# Altium schematic sheet button.SchDoc
size A4
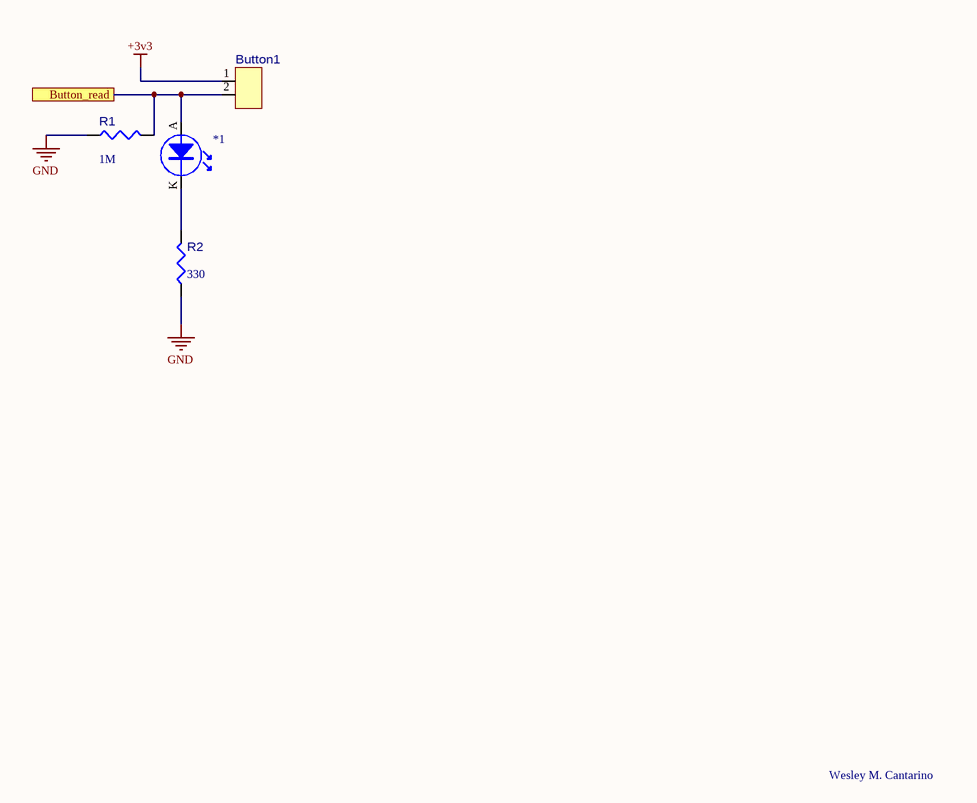
[diagram p0: button.SchDoc]

## Parts
*1  LED_AXIAL_5MM  [HEADER_1X2]  (value not drawn)
Button1  ?  [HEADER_1X2]  (value not drawn)
R1  1M  [RES_PTH_7.62MM]
R2  value 330  [RES_PTH_7.62MM]

## Ports
Button_read

## Nets
+3v3: Button1.1
GND: R1.1 R2.1
Button_read: *1.A Button1.2 R1.2 ; port Button_read
Net*1_K: *1.K R2.2

## Notes on the sheet
- Wesley M. Cantarino

## Library data of the parts
*1 = LED_AXIAL_5MM: pin to pad: A>1 K>2; Value: ?
Button1 = HEADER_1X2: 1X2; Value: ?
R1 R2 = RES_PTH_7.62MM: Pin Through Hole Resistor 7.62mm
  R1: Value: 1M